# EAGLE design ATmega328 (EAGLE 9.6.2)
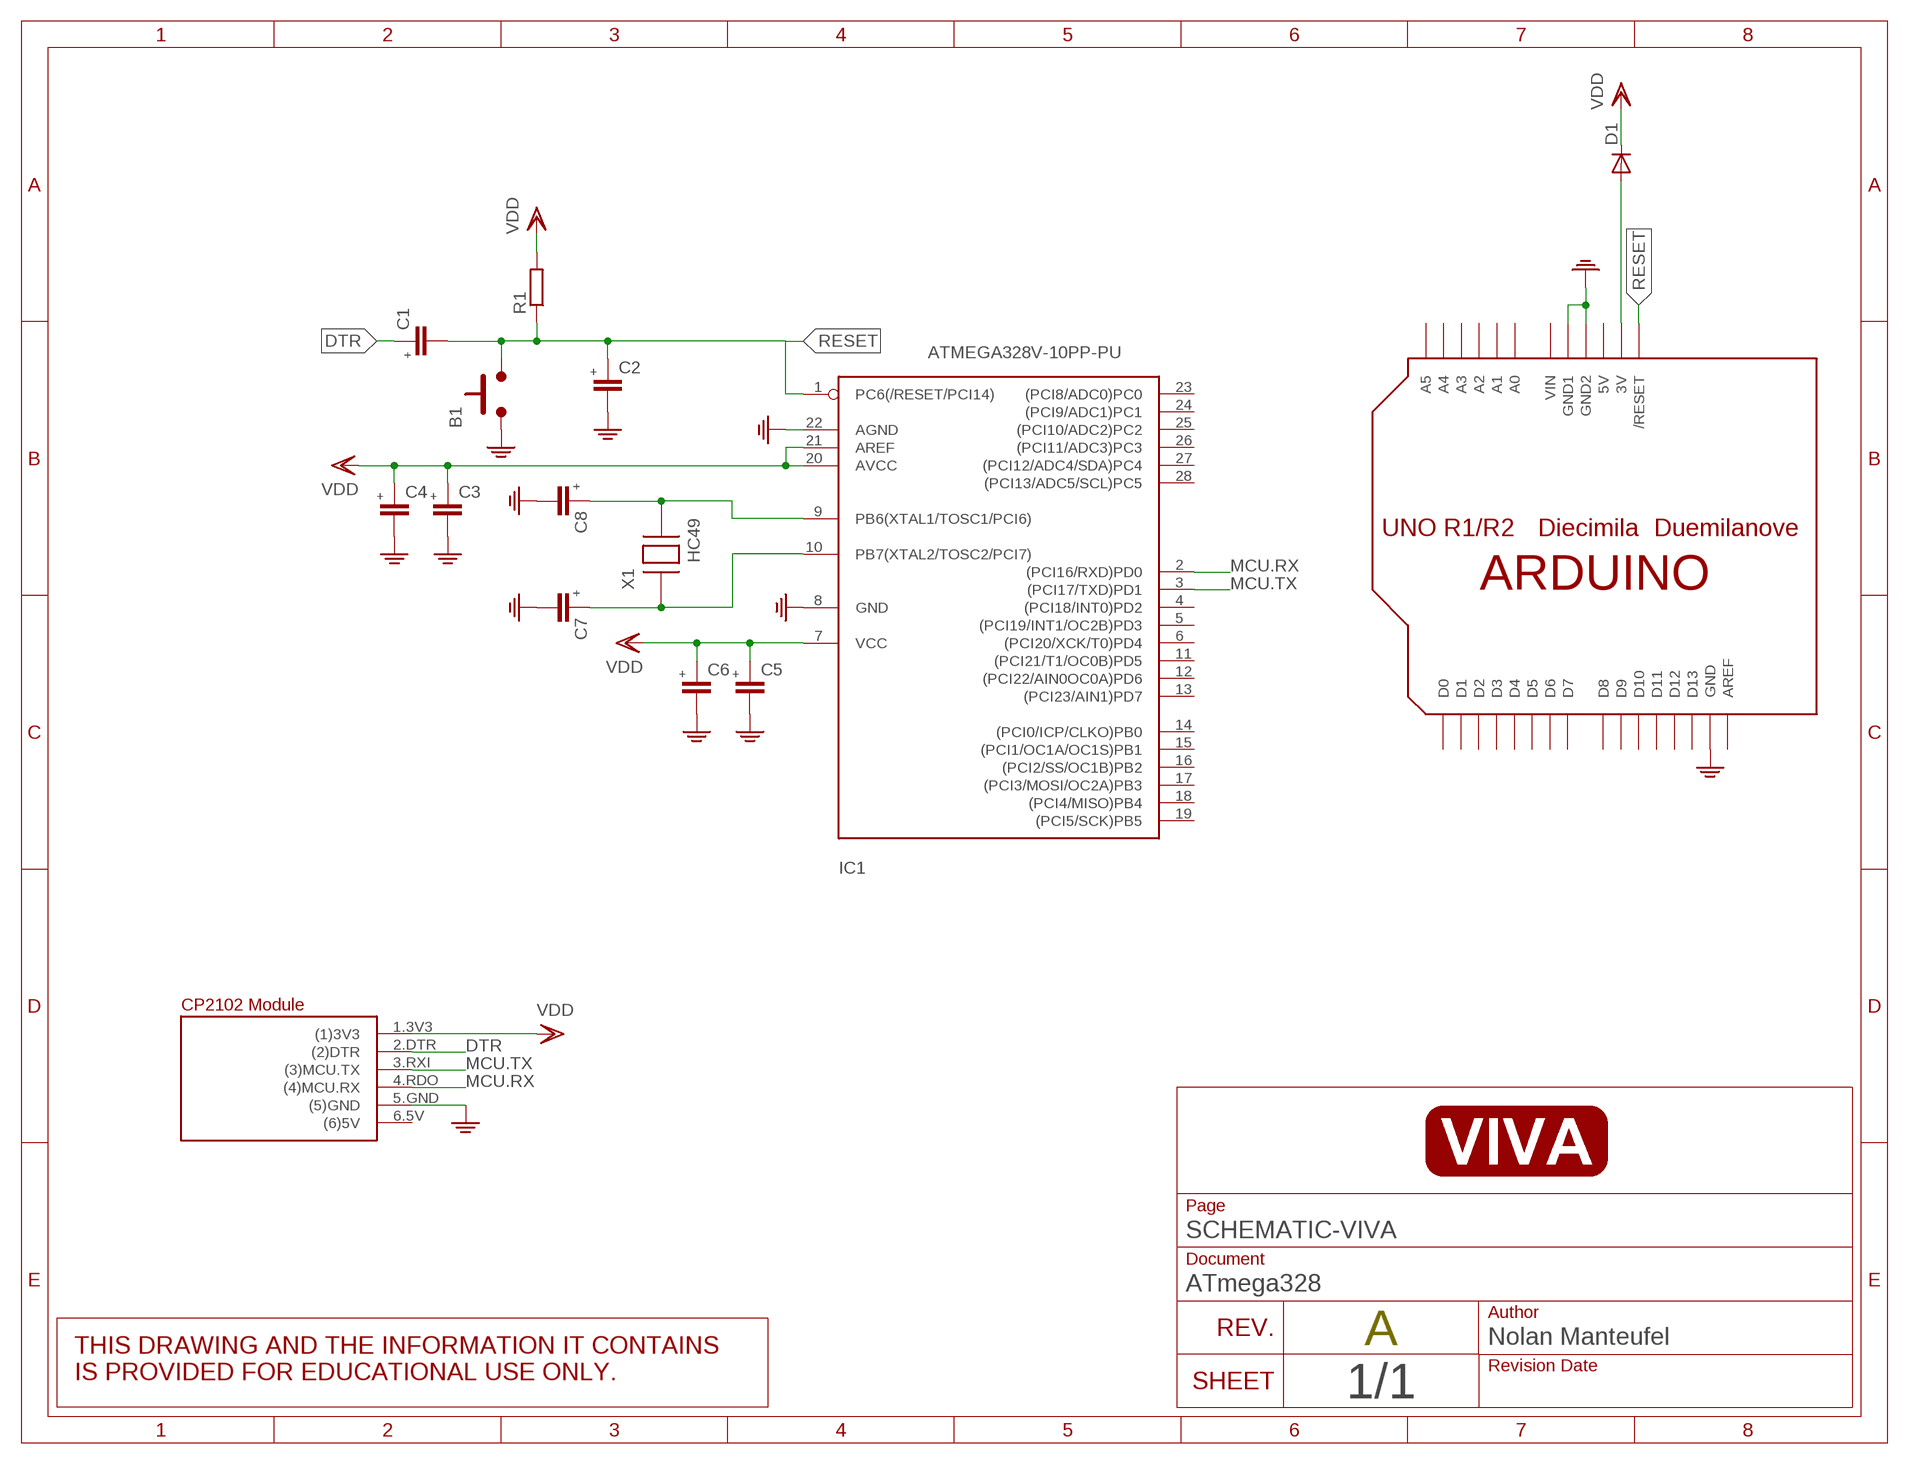
[diagram p0: schematic, sheet 1]

## Parts
B1  PUSHBUTTON6X6MM  [6X6MM]
C1  C-EUC0805  [C0805]
C2  C-EUC0805  [C0805]
C3  C-EUC0805  [C0805]
C4  C-EUC0805  [C0805]
C5  C-EUC0805  [C0805]
C6  C-EUC0805  [C0805]
C7  C-EUC0805  [C0805]
C8  C-EUC0805  [C0805]
D1  DIODE-SOD123  [SOD123]
IC1  ATMEGA328V-10PP-PU  [DIL28-3]
R1  R-EU_R0805  [R0805]
U$2  ARDUINOUNO  [ARDUINO]
U$3  VIVA_USB-TTLTEXT  [VIVA_USB-TTL]
X1  HC49  CRYSTAL-M  [HC49S]

## Nets
DTR: C1.1 U$3.2.DTR((2)DTR)
GND: B1.1.A B1.2.A C2.2 C3.2 C4.2 C5.2 C6.2 C7.2 C8.2 IC1.8(GND) IC1.22(AGND) U$2.GND U$2.GND1 U$2.GND2 U$3.5.GND((5)GND)
MCU.RX: IC1.2((PCI16/RXD)PD0) U$3.4.RDO((4)MCU.RX)
MCU.TX: IC1.3((PCI17/TXD)PD1) U$3.3.RXI((3)MCU.TX)
N$2: D1.A U$2.3V
N$5: C8.1 IC1.9(PB6(XTAL1/TOSC1/PCI6)) X1.P$2
N$6: C7.1 IC1.10(PB7(XTAL2/TOSC2/PCI7)) X1.P$1
RESET: B1.3.B B1.4.B C1.2 C2.1 IC1.1(PC6(/RESET/PCI14)) R1.1 U$2.RESET(/RESET)
VDD: C3.1 C4.1 C5.1 C6.1 D1.C IC1.7(VCC) IC1.20(AVCC) IC1.21(AREF) R1.2 U$3.1.3V3((1)3V3)
Unconnected: IC1.4((PCI18/INT0)PD2) IC1.5((PCI19/INT1/OC2B)PD3) IC1.6((PCI20/XCK/T0)PD4) IC1.11((PCI21/T1/OC0B)PD5) IC1.12((PCI22/AIN0OC0A)PD6) IC1.13((PCI23/AIN1)PD7) IC1.14((PCI0/ICP/CLKO)PB0) IC1.15((PCI1/OC1A/OC1S)PB1) IC1.16((PCI2/SS/OC1B)PB2) IC1.17((PCI3/MOSI/OC2A)PB3) IC1.18((PCI4/MISO)PB4) IC1.19((PCI5/SCK)PB5) IC1.23((PCI8/ADC0)PC0) IC1.24((PCI9/ADC1)PC1) IC1.25((PCI10/ADC2)PC2) IC1.26((PCI11/ADC3)PC3) IC1.27((PCI12/ADC4/SDA)PC4) IC1.28((PCI13/ADC5/SCL)PC5) U$2.A0 U$2.A1 U$2.A2 U$2.A3 U$2.A4 U$2.A5 U$2.AREF U$2.D0 U$2.D1 U$2.D2 U$2.D3 U$2.D4 U$2.D5 U$2.D6 U$2.D7 U$2.D8 U$2.D9 U$2.D10 U$2.D11 U$2.D12 U$2.D13 U$3.6.5V((6)5V)

## Power pins joined to a net without a drawn wire
5V: U$2.5V
VIN: U$2.VIN

## Library data of the parts
B1 = nolan-utsa:PUSHBUTTON: Tactile push button switch
C1-C8 = nolan-utsa:C-EU: CAPACITOR, European symbol
D1 = nolan-utsa:DIODE-: DIODE
IC1 = nolan-utsa:ATMEGA328*P: MICROCONTROLLER 32 kBytes FLASH 2 kBytes SRAM 1 kBytes EEPROM USART 8-channel 10 bit ADC
R1 = nolan-utsa:R-EU_: RESISTOR, European symbol
U$2 = nolan-utsa:ARDUINO: Arduino Diecimila/Duemilanove Make a shield with ease, this package has all the named pins as well as the two mounting drill holes and an outline of the USB and DC power connector. The outline is on the DIMENSION layer, so if your board house uses it they will cut the outline to match. http://www.ladyada.net/library/pcb/eaglelibrary.html
U$3 = nolan-utsa:VIVA_USB-TTL
X1 = nolan-utsa:CRYSTAL: HC49S Crystal Oscillator

## Board
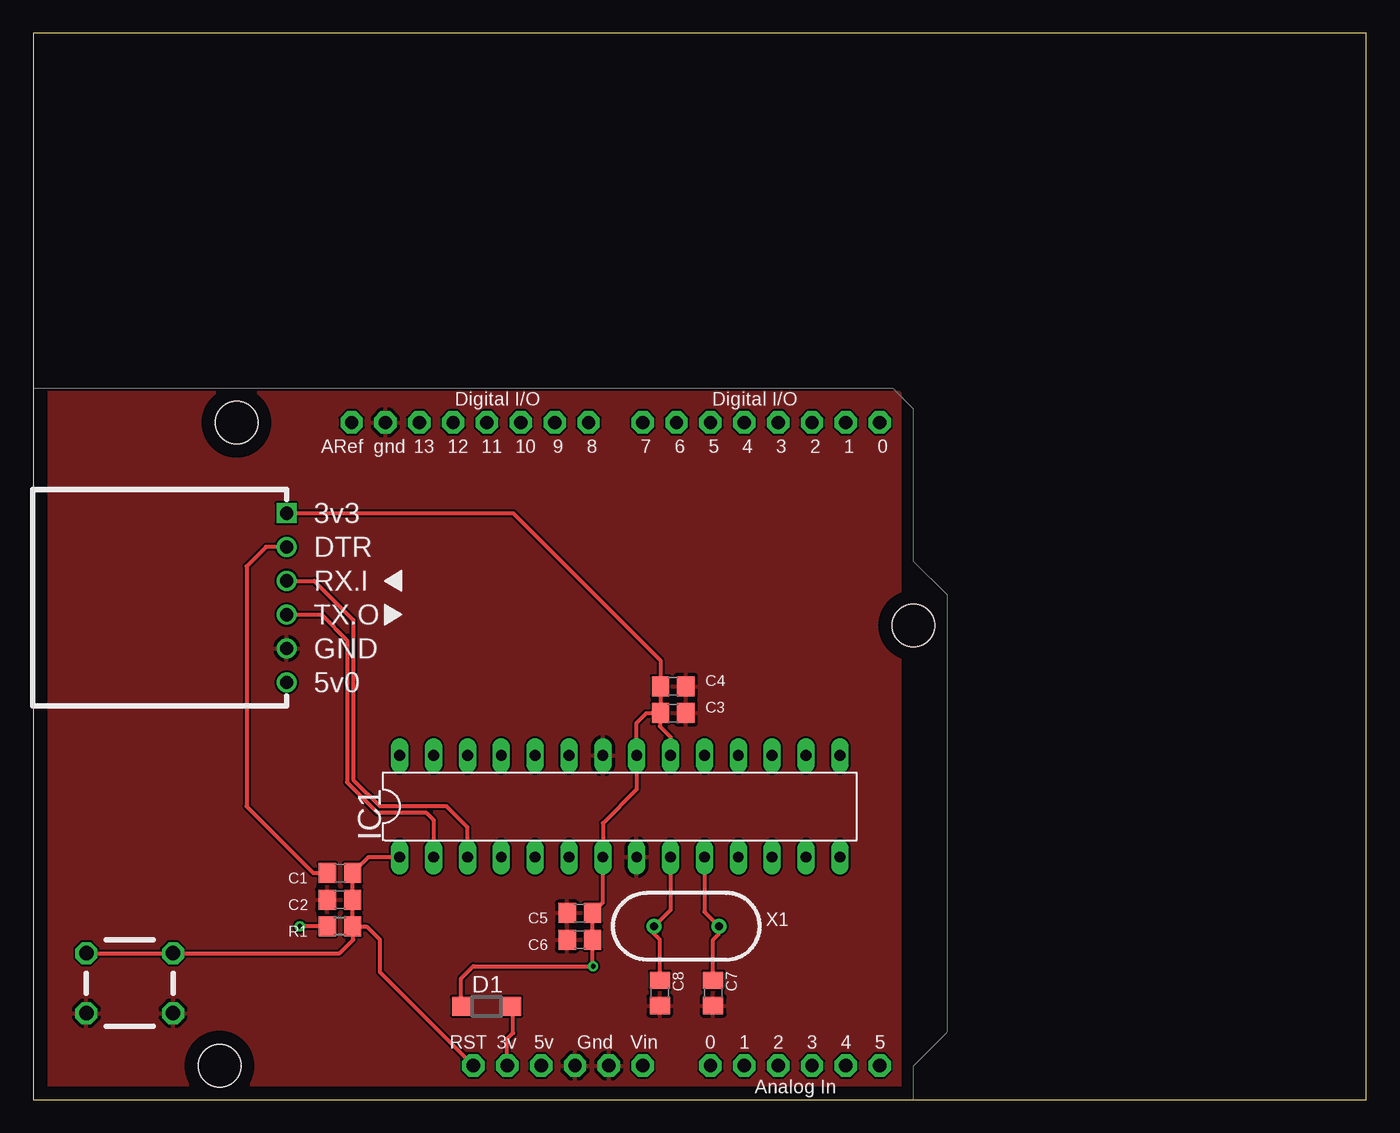
[diagram p1: board, top side]
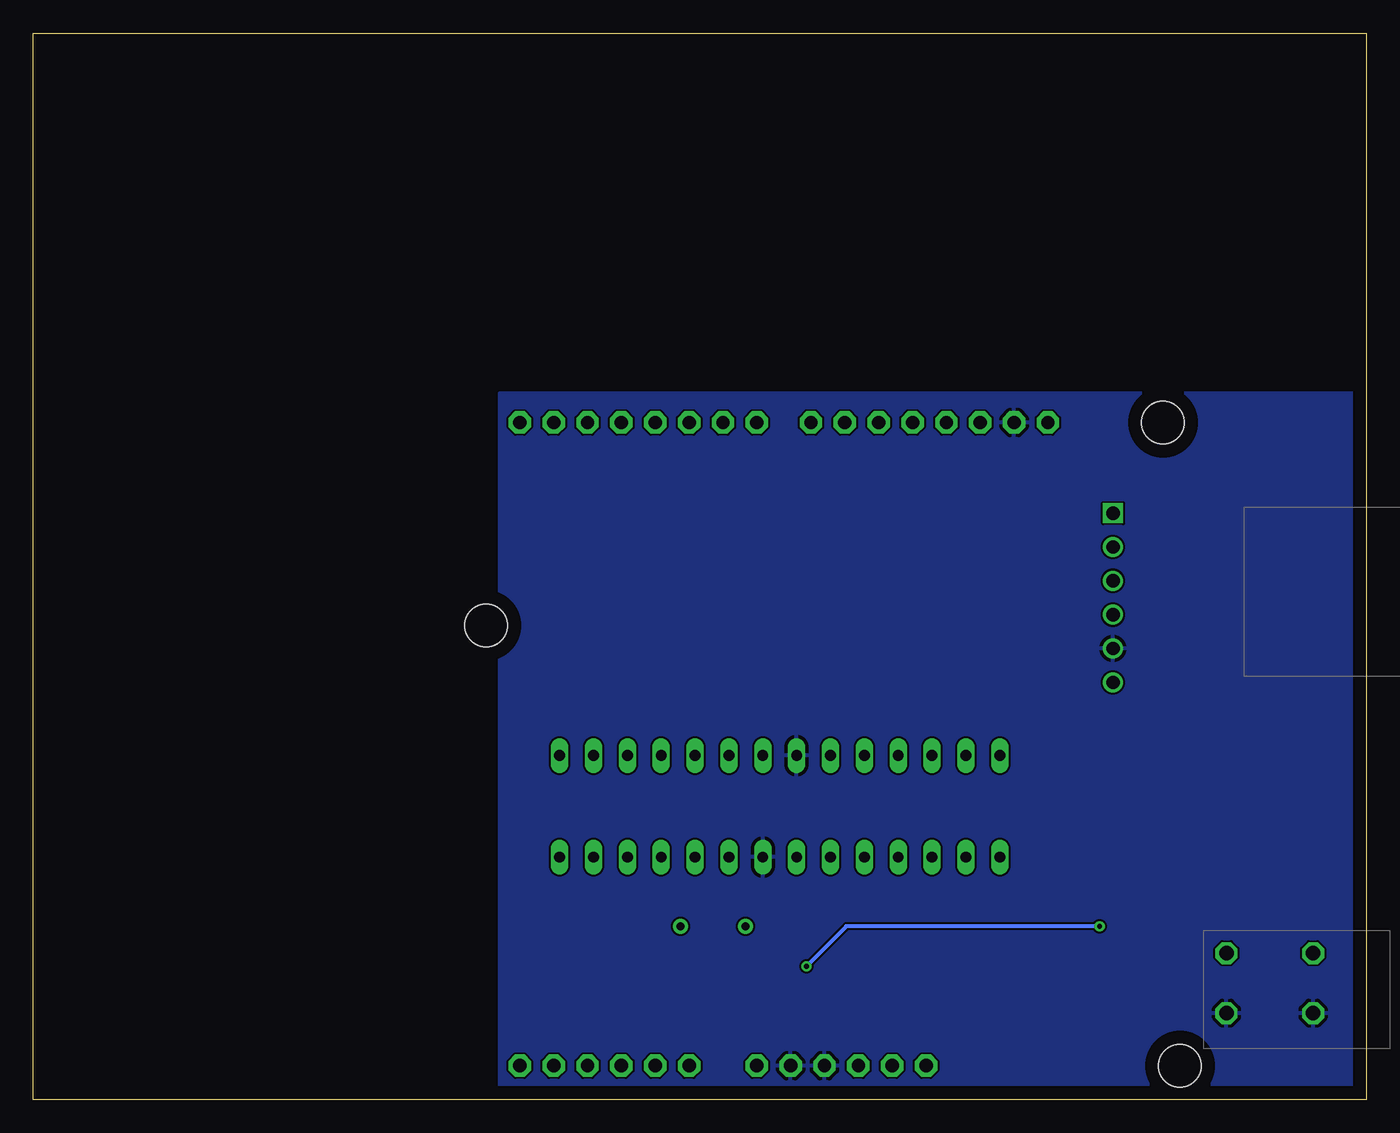
[diagram p2: board, bottom side, seen from below]

Size 100 x 80 mm. Coordinates in mm from the lower left corner, seen from the top.
Outline: 0,0 100,0 100,80 0,80 0,0
Copper layers (1*16): Top 0.035mm / dielectric 1.5mm / Bottom 0.035mm
Design rules "default": minimum track width 6mil, minimum drill 0.35mm, track to track 6mil, track to pad 6mil, pad to pad 6mil, via to via 6mil, smd to smd 6mil, copper to edge 40mil, drill to drill 6mil, minimum pad ring 10mil, minimum via ring 8mil, stop-mask expansion 4mil, vias tented up to drill 0mil, thermal gap 10mil

### Footprints (pad centres in the part's own frame; a part is rotated, then mirrored left to right if it is on the bottom)
6X6MM = drill 1.1 octagon: 1.A 0,0; 2.A 6.5,0; 3.B 0,4.5; 4.B 6.5,4.5
C0805 = smd 1.3 x 1.5: 1 -0.95,0; 2 0.95,0
SOD123 = smd 1.4 x 1.4: A 1.9,0; C -1.9,0
DIL28-3 = drill 0.813 long: 1 -16.51,-3.81; 2 -13.97,-3.81; 3 -11.43,-3.81; 4 -8.89,-3.81; 5 -6.35,-3.81; 6 -3.81,-3.81; 7 -1.27,-3.81; 8 1.27,-3.81; 9 3.81,-3.81; 10 6.35,-3.81; 11 8.89,-3.81; 12 11.43,-3.81; 13 13.97,-3.81; 14 16.51,-3.81; 15 16.51,3.81; 16 13.97,3.81; 17 11.43,3.81; 18 8.89,3.81; 19 6.35,3.81; 20 3.81,3.81; 21 1.27,3.81; 22 -1.27,3.81; 23 -3.81,3.81; 24 -6.35,3.81; 25 -8.89,3.81; 26 -11.43,3.81; 27 -13.97,3.81; 28 -16.51,3.81
R0805 = smd 1.3 x 1.5: 1 -0.95,0; 2 0.95,0
ARDUINO = drill 1 pad 1.676 octagon: 3V 35.56,2.54; 5V 38.1,2.54; A0 50.8,2.54; A1 53.34,2.54; A2 55.88,2.54; A3 58.42,2.54; A4 60.96,2.54; A5 63.5,2.54; AREF 23.876,50.8; D0 63.5,50.8; D1 60.96,50.8; D2 58.42,50.8; D3 55.88,50.8; D4 53.34,50.8; D5 50.8,50.8; D6 48.26,50.8; D7 45.72,50.8; D8 41.656,50.8; D9 39.116,50.8; D10 36.576,50.8; D11 34.036,50.8; D12 31.496,50.8; D13 28.956,50.8; GND 26.416,50.8; GND1 43.18,2.54; GND2 40.64,2.54; RESET 33.02,2.54; VIN 45.72,2.54 | hole 3.2: 15.24,50.8; 66.04,35.56; 13.97,2.54
VIVA_USB-TTL = drill 1 square: 1.3V3 0,0 | drill 1: 2.DTR 0,-2.54; 3.RXI 0,-5.08; 4.RDO 0,-7.62; 5.GND 0,-10.16; 6.5V 0,-12.7
HC49S = drill 0.6: P$1 -2.44,0; P$2 2.44,0

### Placement (x,y rotation side)
B1  3.98,6.48 0 top
C1  23,17 0 top
C2  23,15 180 top
C3  48,29 0 top
C4  48,31 0 top
C5  41,14 180 top
C6  41,12 180 top
C7  51,8 270 top
C8  47,8 270 top
D1  34,7 0 top
IC1  44,22 0 top
R1  23,13 180 top
U$2  0,0 0 top
U$3  19,44 0 top
X1  49,13 180 top

### Tracks (layer width: path | path; a pad name or v marks a point on that pad's centre or on a via)
DTR
  Top 0.305: U$3.2.DTR 17.46,41.46 16,40 16,22 21,17 C1.1
GND
  pour Top: 1,1 65,1 65,53 1,53
  pour Bottom: 1,1 65,1 65,53 1,53
MCU.RX
  Top 0.305: U$3.4.RDO 21.62,36.38 23.54,34.46 23.54,23.81 25.81,21.54 29.46,21.54 30.03,20.97 IC1.2
MCU.TX
  Top 0.305: IC1.3 32.57,20.43 31,22 26,22 24,24 24,36 21.08,38.92 U$3.3.RXI
N$2
  Top 0.305: U$2.3V 35.56,4.56 36,5 36,6.9 D1.A
N$5
  Top 0.305: IC1.9 47.81,14.25 X1.P$2 46.56,12.44 47,12 C8.1
N$6
  Top 0.305: IC1.10 50.35,14.09 X1.P$1 51.44,12.44 51,12 C7.1
RESET
  Top 0.305: B1.3.B B1.4.B 22.98,10.98 24,12 24,12.95 | 24,12.95 R1.1 C2.1 C1.2 25.14,18.19 IC1.1 | U$2.RESET 26,9.56 26,12 25.05,12.95 24,12.95
VDD  (via drill 0.35)
  Top 0.305: U$3.1.3V3 36,44 47.05,32.95 C4.1 C3.1 | C3.1 46,29 45.27,28.27 IC1.21 45.27,23.27 42.73,20.73 IC1.7 42.73,14.78 C5.1 C6.1 41.95,10.05 v42,10 33,10 32.1,9.1 D1.C | C3.1 47,28.95 47,28 47.81,27.19 IC1.20 | R1.2 v20,13
  Bottom 0.305: v20,13 39,13 v42,10